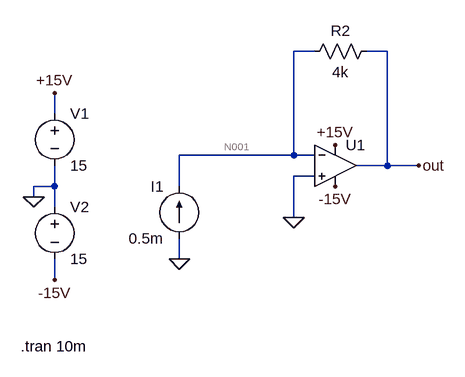
[diagram p0: schematic sim_c.asc]
sim_c.asc, the LTspice schematic file:
Version 4
SHEET 1 880 680
WIRE 144 -112 112 -112
WIRE 256 -112 224 -112
WIRE -256 -16 -256 -48
WIRE 112 48 112 -112
WIRE 112 48 -64 48
WIRE 144 48 112 48
WIRE 256 64 256 -112
WIRE 256 64 208 64
WIRE 304 64 256 64
WIRE 144 80 112 80
WIRE -256 96 -256 64
WIRE -256 96 -288 96
WIRE -64 96 -64 48
WIRE -288 112 -288 96
WIRE -256 128 -256 96
WIRE 112 144 112 80
WIRE -64 208 -64 176
WIRE -256 240 -256 208
FLAG -288 112 0
FLAG -256 -48 +15V
FLAG -256 240 -15V
FLAG 176 32 +15V
FLAG 176 96 -15V
FLAG -64 208 0
FLAG 112 144 0
FLAG 304 64 out
SYMBOL OpAmps\\UniversalOpAmp2 176 64 R0
SYMATTR InstName U1
SYMBOL voltage -256 -32 R0
WINDOW 123 0 0 Left 0
WINDOW 39 0 0 Left 0
SYMATTR InstName V1
SYMATTR Value 15
SYMBOL voltage -256 112 R0
WINDOW 123 0 0 Left 0
WINDOW 39 0 0 Left 0
SYMATTR InstName V2
SYMATTR Value 15
SYMBOL res 128 -96 R270
WINDOW 0 32 56 VTop 2
WINDOW 3 0 56 VBottom 2
SYMATTR InstName R2
SYMATTR Value 4k
SYMBOL current -64 176 R180
WINDOW 0 24 80 Left 2
WINDOW 3 24 0 Left 2
WINDOW 123 0 0 Left 0
WINDOW 39 0 0 Left 0
SYMATTR InstName I1
SYMATTR Value 0.5m
TEXT -308 342 Left 2 !.tran 10m

The netlist it stands for:
* sim_c.asc
XU1 0 N001 +15V -15V out level2 Avol=1Meg GBW=10Meg Slew=10Meg Ilimit=25m Rail=0 Vos=0 En=0 Enk=0 In=0 Ink=0 Rin=500Meg  ; pins In+ In- V+ V- OUT
V1 +15V 0 15
V2 0 -15V 15
R2 N001 out 4k
I1 0 N001 0.5m
.tran 10m
.lib UniversalOpAmp2.lib
.backanno
.end

* Results of the author's LTspice run, read from the files saved beside the schematic
* Operating Point, zero values left out:
*   V(out) = -2 V
*   V(+15v) = 15 V
*   V(-15v) = -15 V
*   V(n001) = 2.007 µV
*   I(I1) = 500 µA
*   I(R2) = 500 µA
*   I(V2) = -1.756 mA
*   I(V1) = -1.256 mA
*   Ix(u1:3) = 1.256 mA
*   Ix(u1:4) = -1.756 mA
*   Ix(u1:5) = 500 µA